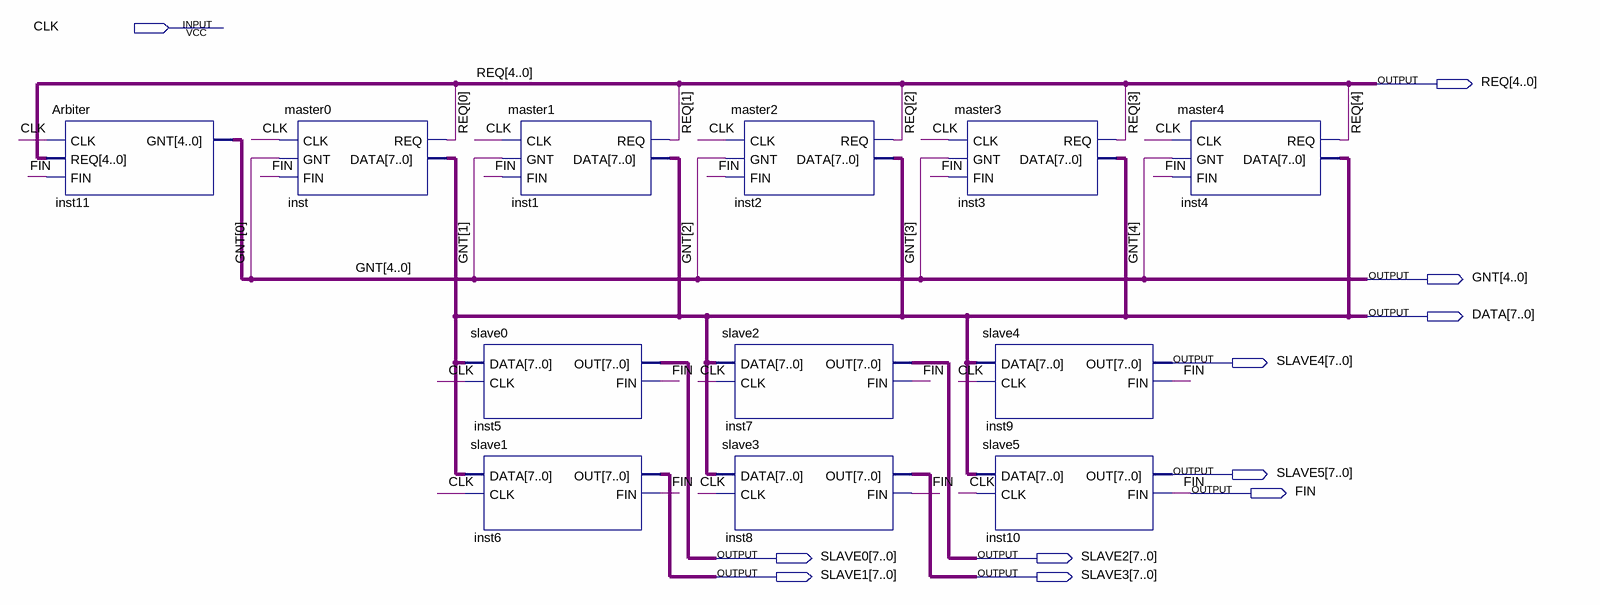
[diagram p0: schematic sheet]
// Quartus schematic Lab5.bdf as structural Verilog: 12 symbols, 11 pins
module Lab5 (
  input  CLK,
  output [4:0] REQ,
  output [4:0] GNT,
  output [7:0] DATA,
  output [7:0] SLAVE4,
  output [7:0] SLAVE5,
  output FIN,
  output [7:0] SLAVE0,
  output [7:0] SLAVE2,
  output [7:0] SLAVE1,
  output [7:0] SLAVE3
);

  Arbiter inst11 (.CLK(CLK), .REQ(REQ), .FIN(FIN), .GNT(GNT));
  master0 inst (.CLK(CLK), .GNT(GNT[0]), .FIN(FIN), .REQ(REQ[0]), .DATA(DATA));
  slave0 inst5 (.DATA(DATA), .CLK(CLK), .OUT(SLAVE0), .FIN(FIN));
  slave1 inst6 (.DATA(DATA), .CLK(CLK), .OUT(SLAVE1), .FIN(FIN));
  master1 inst1 (.CLK(CLK), .GNT(GNT[1]), .FIN(FIN), .REQ(REQ[1]), .DATA(DATA));
  master2 inst2 (.CLK(CLK), .GNT(GNT[2]), .FIN(FIN), .REQ(REQ[2]), .DATA(DATA));
  slave2 inst7 (.DATA(DATA), .CLK(CLK), .OUT(SLAVE2), .FIN(FIN));
  slave3 inst8 (.DATA(DATA), .CLK(CLK), .OUT(SLAVE3), .FIN(FIN));
  master3 inst3 (.CLK(CLK), .GNT(GNT[3]), .FIN(FIN), .REQ(REQ[3]), .DATA(DATA));
  slave4 inst9 (.DATA(DATA), .CLK(CLK), .OUT(SLAVE4), .FIN(FIN));
  slave5 inst10 (.DATA(DATA), .CLK(CLK), .OUT(SLAVE5), .FIN(FIN));
  master4 inst4 (.CLK(CLK), .GNT(GNT[4]), .FIN(FIN), .REQ(REQ[4]), .DATA(DATA));
endmodule
